# Altium project UL-SWAP-DAQ-2-MODULE.PrjPcb
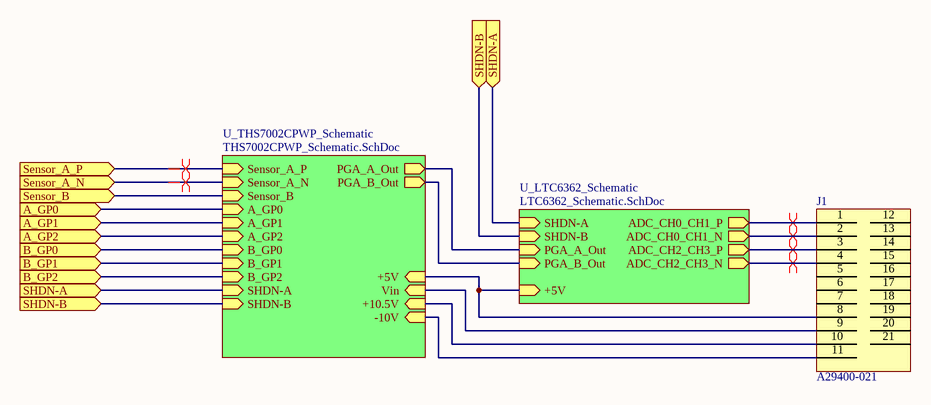
[diagram p0: CONNECTED-MODULE.SchDoc]
3 sheets, 47 parts. Net scope: hierarchical (ports join the sheet entries above them; power ports are global).
Board file: UL-SWAP-DAQ-3-MODULE.PcbDoc
Sheets:
  CONNECTED-MODULE.SchDoc
    U_LTC6362_Schematic = LTC6362_Schematic.SchDoc
    U_THS7002CPWP_Schematic = THS7002CPWP_Schematic.SchDoc

## Sheet CONNECTED-MODULE.SchDoc
size A; SheetNumber: 1; SheetTotal: 3

### Parts
J1  A29400-021

### Sub-sheets
U_LTC6362_Schematic = LTC6362_Schematic.SchDoc: SHDN-A (in), SHDN-B (in), ADC_CH2_CH3_P (out), ADC_CH2_CH3_N (out), ADC_CH0_CH1_P (out), ADC_CH0_CH1_N (out), PGA_A_Out (in), PGA_B_Out (in), +5V (in)
U_THS7002CPWP_Schematic = THS7002CPWP_Schematic.SchDoc: Sensor_A_P (in), Sensor_A_N (in), Sensor_B (in), A_GP0 (in), B_GP0 (in), A_GP1 (in), A_GP2 (in), B_GP1 (in), B_GP2 (in), SHDN-A (in), SHDN-B (in), PGA_A_Out (out), PGA_B_Out (out), +10.5V (in), -10V (in), +5V (in), Vin (in)

### Ports
A_GP0 (in), A_GP1 (in), A_GP2 (in), B_GP0 (in), B_GP1 (in), B_GP2 (in), Sensor_A_N (in), Sensor_A_P (in), Sensor_B (in), SHDN-A (in), SHDN-B (in)

### Nets
+5V: J1.8 ; sheet U_LTC6362_Schematic/+5V, sheet U_THS7002CPWP_Schematic/+5V
+10.5V: J1.10 ; sheet U_THS7002CPWP_Schematic/+10.5V
-10V: J1.11 ; sheet U_THS7002CPWP_Schematic/-10V
A_GP0: port A_GP0, sheet U_THS7002CPWP_Schematic/A_GP0
A_GP1: port A_GP1, sheet U_THS7002CPWP_Schematic/A_GP1
A_GP2: port A_GP2, sheet U_THS7002CPWP_Schematic/A_GP2
ADC_CH0_CH1_N: J1.2 ; sheet U_LTC6362_Schematic/ADC_CH0_CH1_N
ADC_CH0_CH1_P: J1.1 ; sheet U_LTC6362_Schematic/ADC_CH0_CH1_P
ADC_CH2_CH3_N: J1.4 ; sheet U_LTC6362_Schematic/ADC_CH2_CH3_N
ADC_CH2_CH3_P: J1.3 ; sheet U_LTC6362_Schematic/ADC_CH2_CH3_P
B_GP0: port B_GP0, sheet U_THS7002CPWP_Schematic/B_GP0
B_GP1: port B_GP1, sheet U_THS7002CPWP_Schematic/B_GP1
B_GP2: port B_GP2, sheet U_THS7002CPWP_Schematic/B_GP2
PGA_A_Out: sheet U_LTC6362_Schematic/PGA_A_Out, sheet U_THS7002CPWP_Schematic/PGA_A_Out
PGA_B_Out: sheet U_LTC6362_Schematic/PGA_B_Out, sheet U_THS7002CPWP_Schematic/PGA_B_Out
Sensor_A_N: port Sensor_A_N, sheet U_THS7002CPWP_Schematic/Sensor_A_N
Sensor_A_P: port Sensor_A_P, sheet U_THS7002CPWP_Schematic/Sensor_A_P
Sensor_B: port Sensor_B, sheet U_THS7002CPWP_Schematic/Sensor_B
SHDN-A: port SHDN-A, sheet U_LTC6362_Schematic/SHDN-A, sheet U_THS7002CPWP_Schematic/SHDN-A
SHDN-B: port SHDN-B, sheet U_LTC6362_Schematic/SHDN-B, sheet U_THS7002CPWP_Schematic/SHDN-B
Vin: J1.9 ; sheet U_THS7002CPWP_Schematic/Vin

Not connected (* = marked no-connect by the designer): J1 5 6 7 12 13 14 15 16 17 18 19 20 21

### Layout directives
differential pair: ADC_CH0_CH1_N, ADC_CH0_CH1_P, ADC_CH2_CH3_N, ADC_CH2_CH3_P, Sensor_A_N, Sensor_A_P

### Library data of the parts
J1 = A29400-021: 21 Position D-Type, Nano-D Receptacle, Female Sockets Connector

## Sheet LTC6362_Schematic.SchDoc
size A; SheetNumber: 2; SheetTotal: 3
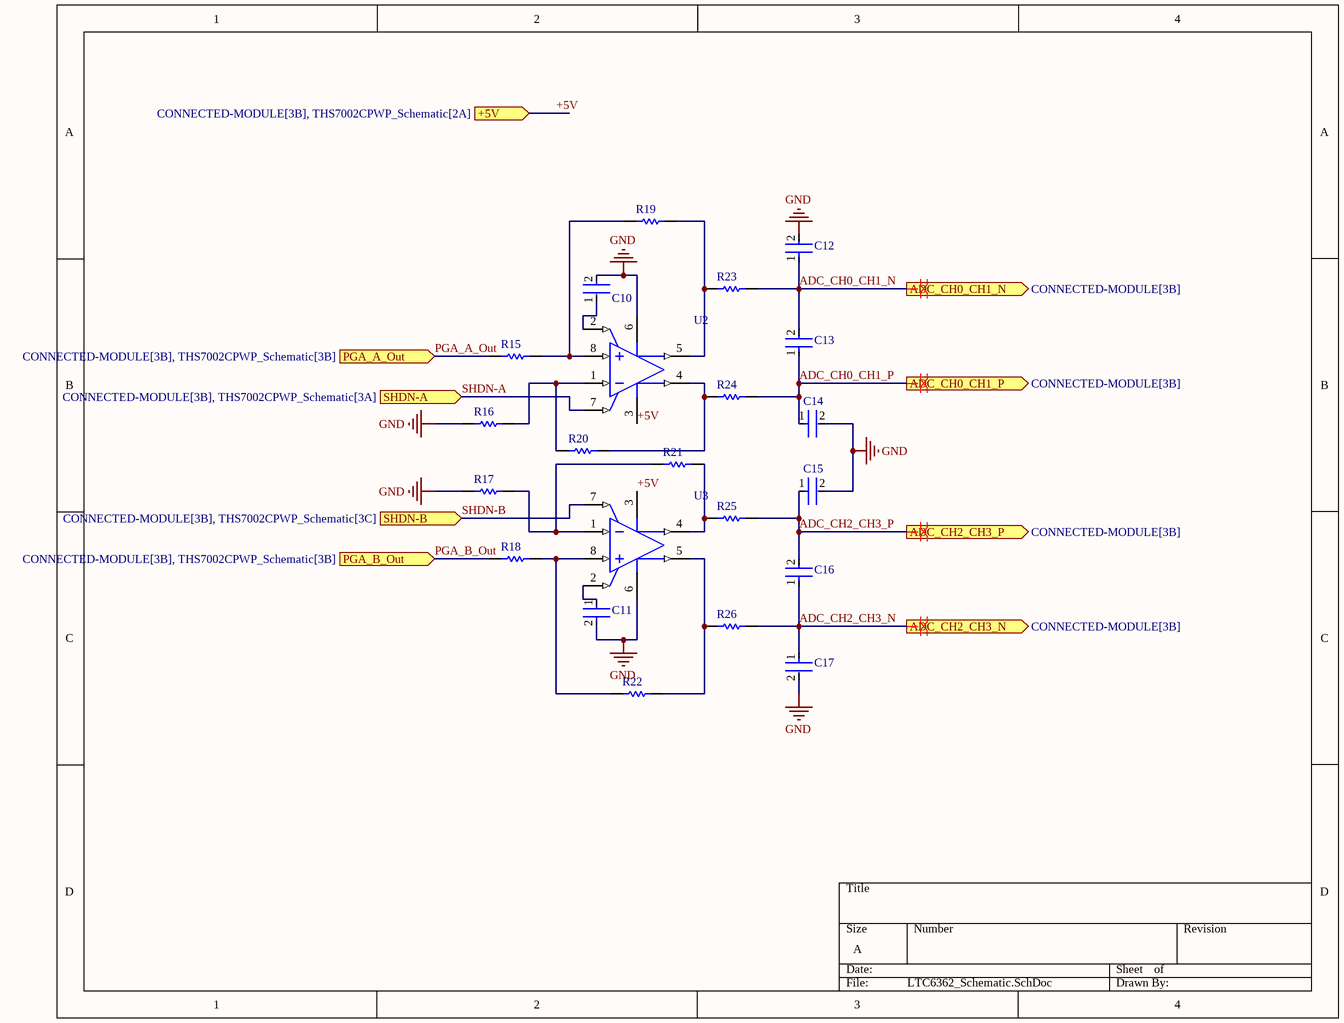
[diagram p1: LTC6362_Schematic.SchDoc]

### Parts
C10  GRM155R71C104KA88D  [FP-GRM15-MFG]  (value not drawn)
C11  GRM155R71C104KA88D  [FP-GRM15-MFG]  (value not drawn)
C12  C0402C392K3RACTU  [FP-C0402-BB-MFG]  (value not drawn)
C13  C0402C392K3RACTU  [FP-C0402-BB-MFG]  (value not drawn)
C14  C0402C392K3RACTU  [FP-C0402-BB-MFG]  (value not drawn)
C15  C0402C392K3RACTU  [FP-C0402-BB-MFG]  (value not drawn)
C16  C0402C392K3RACTU  [FP-C0402-BB-MFG]  (value not drawn)
C17  C0402C392K3RACTU  [FP-C0402-BB-MFG]  (value not drawn)
R15  ERJ-2RKF1241X  [RESC1005X40X25ML05T05]  (value not drawn)
R16  ERJ-2RKF1241X  [RESC1005X40X25ML05T05]  (value not drawn)
R17  ERJ-2RKF1241X  [RESC1005X40X25ML05T05]  (value not drawn)
R18  ERJ-2RKF1241X  [RESC1005X40X25ML05T05]  (value not drawn)
R19  ERJ-2RKF1001X  [RESC1005X40X25NL05T05]  (value not drawn)
R20  ERJ-2RKF1001X  [RESC1005X40X25NL05T05]  (value not drawn)
R21  ERJ-2RKF1001X  [RESC1005X40X25NL05T05]  (value not drawn)
R22  ERJ-2RKF1001X  [RESC1005X40X25NL05T05]  (value not drawn)
R23  RC0402FR-0735R7L  [RESC1005X40X25ML05T10]  (value not drawn)
R24  RC0402FR-0735R7L  [RESC1005X40X25ML05T10]  (value not drawn)
R25  RC0402FR-0735R7L  [RESC1005X40X25ML05T10]  (value not drawn)
R26  RC0402FR-0735R7L  [RESC1005X40X25ML05T10]  (value not drawn)
U2  LTC6362HMS8#PBF  [LT-MS8-8_L]  (value not drawn)
U3  LTC6362HMS8#PBF  [LT-MS8-8_L]  (value not drawn)

### Ports
+5V (in, see CONNECTED-MODULE[3B], THS7002CPWP_Schematic[2A]), ADC_CH0_CH1_N (out, see CONNECTED-MODULE[3B]), ADC_CH0_CH1_P (out, see CONNECTED-MODULE[3B]), ADC_CH2_CH3_N (out, see CONNECTED-MODULE[3B]), ADC_CH2_CH3_P (out, see CONNECTED-MODULE[3B]), PGA_A_Out (in, see CONNECTED-MODULE[3B], THS7002CPWP_Schematic[3B]), PGA_B_Out (in, see CONNECTED-MODULE[3B], THS7002CPWP_Schematic[3B]), SHDN-A (in, see CONNECTED-MODULE[3B], THS7002CPWP_Schematic[3A]), SHDN-B (in, see CONNECTED-MODULE[3B], THS7002CPWP_Schematic[3C])

### Nets
GND: C10.2 C11.2 C12.2 C14.2 C15.2 C17.2 R16.1 R17.1 U2.6(V-) U3.6(V-)
+5V: U2.3(V+) U3.3(V+) ; port +5V
ADC_CH0_CH1_N: C12.1 C13.2 R23.2 ; port ADC_CH0_CH1_N
ADC_CH0_CH1_P: C13.1 C14.1 R24.2 ; port ADC_CH0_CH1_P
ADC_CH2_CH3_N: C16.1 C17.1 R26.2 ; port ADC_CH2_CH3_N
ADC_CH2_CH3_P: C15.1 C16.2 R25.2 ; port ADC_CH2_CH3_P
PGA_A_Out: R15.1 ; port PGA_A_Out
PGA_B_Out: R18.1 ; port PGA_B_Out
SHDN-A: U2.7(~{SHDN}) ; port SHDN-A
SHDN-B: U3.7(~{SHDN}) ; port SHDN-B
NetC10_1: C10.1 U2.2(VOCM)
NetC11_1: C11.1 U3.2(VOCM)
NetR15_2: R15.2 R19.1 U2.8(+IN)
NetR16_2: R16.2 R20.1 U2.1(-IN)
NetR17_2: R17.2 R21.1 U3.1(-IN)
NetR18_2: R18.2 R22.1 U3.8(+IN)
NetR19_2: R19.2 R23.1 U2.5(-OUT)
NetR20_2: R20.2 R24.1 U2.4(+OUT)
NetR21_2: R21.2 R25.1 U3.4(+OUT)
NetR22_2: R22.2 R26.1 U3.5(-OUT)

### Layout directives
differential pair: ADC_CH0_CH1_N, ADC_CH0_CH1_P, ADC_CH2_CH3_N, ADC_CH2_CH3_P

### Library data of the parts
C10 C11 = CMP-2100-03641-2: CAP CER 0.1UF 16V X7R 0402; Manufacturer: Murata; Standoff Height: 0mm; Tolerance: 10%; Voltage Rating: 16Vdc; Material: Ceramic; Capacitance: 0.10μF; Value: 0.10μF; RoHS: TRUE; Manufacturer Part Number: GRM155R71C104KA88D; Temperature Characteristic: X7R; Octopart: https://octopart.com/grm155r71c104ka88d-murata-196880; Digikey Description: CAP CER 0.1UF 16V X7R 0402; Device Class L3: Ceramic Capacitors; Height: 0.55mm; ComponentLink2Description: Datasheet; Temperature Range Low: -55°C; Ipc Land Pattern Name: CAPC10050X219; ComponentLink2URL: https://search.murata.co.jp/Ceramy/image/img/A01X/G101/ENG/GRM155R71H471KA01-01A.pdf; Device Class L1: Passive Components; Lead Free: yes; Category: Cap; Package: GRM15; Temperature: -55°C to +125°C; Device Class L2: Capacitors; Temperature Range High: +125°C; Mouser Description: 0402 0.1 uF 16V ±10 % Tolerance X7R SMT Multilayer Ceramic Capacitor
C12-C17 = CMP-2008-03191-2: CAP CER 3900PF 25V X7R 0402; Manufacturer: Kemet; Value: 3,900 pF; Material: Ceramic; Temperature Coefficient: 15%; Tolerance: 0.1; Temperature Characteristic: X7R; Height: 0.55mm; Temperature: -55°C to +125°C; Temperature Range High: +125°C; Automotive: No; RoHS: TRUE; Manufacturer Part Number: C0402C392K3RACTU; Mouser Description: Capacitor; Ceramic; Cap 3900pF; Tol 10%; SMT; Vol-Rtg 50V; X7R; ComponentLink2URL: https://content.kemet.com/datasheets/KEM_C1002_X7R_SMD.pdf; Octopart: https://octopart.com/c0402c392k3ractu-kemet-141288; Category: Cap; Lead Free: Yes; Device Class L1: Passive Components; Package: C0402-BB; ComponentLink2Description: Datasheet; Digikey Description: CAP CER 3900PF 25V X7R 0402; Voltage Rating: 25 V; Capacitance: 3,900 pF; Ipc Land Pattern Name: CAPC10050X50; Temperature Range Low: -55°C; Device Class L2: Capacitors; Device Class L3: Ceramic Capacitors
R15-R18 = CMP-2002-00652-1: Manufacturer: Panasonic; Part Number: ERJ-2RKF1241X
R19-R22 = CMP-1011-00510-4: Chip Resistor, 1 KOhm, +/- 1%, 100 mW, -55 to 155 degC, 0402 (1005 Metric), RoHS, Tape and Reel; Manufacturer: Basic Passives; Voltage Rating: 50 V; Case\/Package: 0402; Resistance: 1 KOhm; Power Rating: 100 mW; PartNumber: ERJ-2RKF1001X; DatasheetVersion: 04/2015; Radiation Hardening: No; Pins: 2; Height: 0.35 mm; RoHSCompliant: true; Case Code (Imperial): 0402; ComponentLink2Description: Datasheet; ComponentLink1Description: Manufacturer URL; PackageReference: 0402; Mount: Surface Mount; Package Quantity: 10000; Tolerance: 1%; ComponentLink1URL: http://www.panasonic.com/; PackageDescription: 2-Pin Surface Mount Device, Body 1 x 0.5 mm; Mounting Technology: Surface Mount; Case Code (Metric): 1005; ComponentLink2URL: http://industrial.panasonic.com/cdbs/www-data/pdf/RDA0000/AOA0000C86.pdf; REACH SVHC: Yes; Packaging: Tape and Reel; Max Operating Temperature: 155 degC; Min Operating Temperature: -55 degC; Width: 0.5 mm; Length: 1 mm
R23-R26 = CMP-2002-07630-1: Manufacturer: Yageo; Part Number: RC0402FR-0735R7L
U2 U3 = CMP-0359-00920-2: Single Channel, Precision, Low Power Differential Operational Amplifier / SAR ADC Driver, RRIO, 180 MHz Typical GBW, 45 V/us Typical SR, 2.8 to 5.25 V, 8-Pin SOP (MS8-8), High Temperature / Automotive, Pb-Free; Manufacturer: Linear Technology; Vs Max (V): 5.25; Is (mA) Typical: 0.9; SR (V/us) Typical: 45; Channels (#): 1; GBW (MHz) Typical: 180; Vos (mV) Typical: 0.05; Vs Min (V): 2.8; PartNumber: LTC6362HMS8#PBF; PackageDescription: 8-Lead Plastic Small Outline, Body 3.9 x 4.9 mm, Pitch 1.27 mm; ComponentLink2Description: Datasheet; ComponentLink3URL: http://cds.linear.com/docs/en/packaging/05081610_G_SO8.pdf; ComponentLink1Description: Manufacturer URL; PackageReference: LT-MS8-8; ComponentLink2URL: http://cds.linear.com/docs/en/datasheet/6362fa.pdf; PackageVersion: Rev G; Mounting Technology: Surface Mount; Linear Technology Part Number: LTC6362; DatasheetVersion: Rev. A; RevisionNote: URLs updated; RoHS: Pb-Free; ComponentLink1URL: http://www.linear.com/; Type: DIFF; ComponentLink3Description: Package Specification

## Sheet THS7002CPWP_Schematic.SchDoc
size A; SheetNumber: 3; SheetTotal: 3
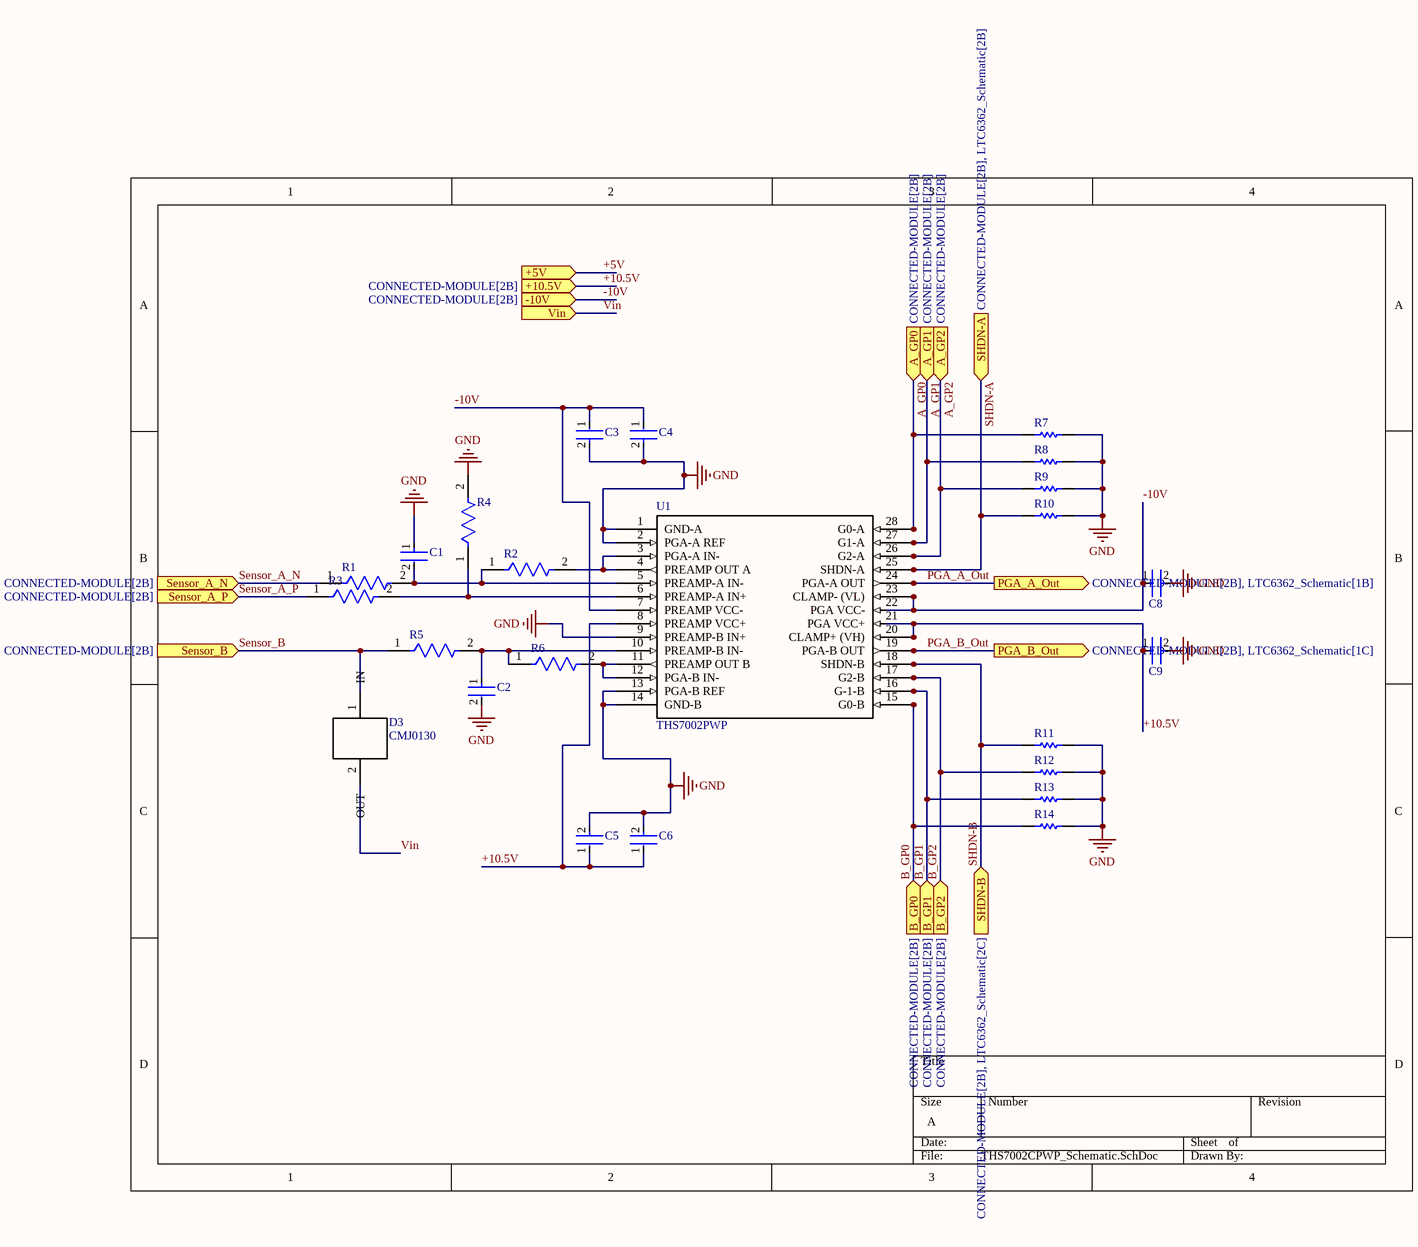
[diagram p2: THS7002CPWP_Schematic.SchDoc]

### Parts
C1  GRM1557U1A302JA01D  [FP-GRM155-0_05-IPC_B]  (value not drawn)
C2  C0603C622J5GACTU  [FP-C0603C-CF-MFG]  (value not drawn)
C3  GRM155R71C104KA88D  [FP-GRM15-MFG]  (value not drawn)
C4  C1608X5R1A685K080AC  [FP-C1608-080-0_1-IPC_B]  (value not drawn)
C5  GRM155R71C104KA88D  [FP-GRM15-MFG]  (value not drawn)
C6  C1608X5R1A685K080AC  [FP-C1608-080-0_1-IPC_B]  (value not drawn)
C8  GRM155R71C104KA88D  [FP-GRM15-MFG]  (value not drawn)
C9  GRM155R71C104KA88D  [FP-GRM15-MFG]  (value not drawn)
D3  CMJ0130  [CMJ2000_Footprint]
R1  CRCW0402499RFKED  [FP-CRCW0402-e3-IPC_A]  (value not drawn)
R2  CRCW0402499RFKED  [FP-CRCW0402-e3-IPC_A]  (value not drawn)
R3  CRCW0402499RFKED  [FP-CRCW0402-e3-IPC_A]  (value not drawn)
R4  CRCW0402499RFKED  [FP-CRCW0402-e3-IPC_A]  (value not drawn)
R5  CRCW0402499RFKED  [FP-CRCW0402-e3-IPC_A]  (value not drawn)
R6  CRCW0402499RFKED  [FP-CRCW0402-e3-IPC_A]  (value not drawn)
R7  ERJ-2RKF3301X  [RESC1005X40X25ML05T05]  (value not drawn)
R8  ERJ-2RKF3301X  [RESC1005X40X25ML05T05]  (value not drawn)
R9  ERJ-2RKF3301X  [RESC1005X40X25ML05T05]  (value not drawn)
R10  ERJ-2RKF3301X  [RESC1005X40X25ML05T05]  (value not drawn)
R11  ERJ-2RKF3301X  [RESC1005X40X25ML05T05]  (value not drawn)
R12  ERJ-2RKF3301X  [RESC1005X40X25ML05T05]  (value not drawn)
R13  ERJ-2RKF3301X  [RESC1005X40X25ML05T05]  (value not drawn)
R14  ERJ-2RKF3301X  [RESC1005X40X25ML05T05]  (value not drawn)
U1  THS7002PWP  [PWP0028E_N]

### Ports
+5V (in), +10.5V (in, see CONNECTED-MODULE[2B]), -10V (in, see CONNECTED-MODULE[2B]), A_GP0 (in, see CONNECTED-MODULE[2B]), A_GP1 (in, see CONNECTED-MODULE[2B]), A_GP2 (in, see CONNECTED-MODULE[2B]), B_GP0 (in, see CONNECTED-MODULE[2B]), B_GP1 (in, see CONNECTED-MODULE[2B]), B_GP2 (in, see CONNECTED-MODULE[2B]), PGA_A_Out (out, see CONNECTED-MODULE[2B], LTC6362_Schematic[1B]), PGA_B_Out (out, see CONNECTED-MODULE[2B], LTC6362_Schematic[1C]), Sensor_A_N (in, see CONNECTED-MODULE[2B]), Sensor_A_P (in, see CONNECTED-MODULE[2B]), Sensor_B (in, see CONNECTED-MODULE[2B]), SHDN-A (in, see CONNECTED-MODULE[2B], LTC6362_Schematic[2B]), SHDN-B (in, see CONNECTED-MODULE[2B], LTC6362_Schematic[2C]), Vin (in)

### Nets
GND: C1.1 C2.2 C3.2 C4.2 C5.2 C6.2 C8.2 C9.2 R4.2 R7.2 R8.2 R9.2 R10.2 R11.2 R12.2 R13.2 R14.2 U1.1(GND-A) U1.2(PGA-A_REF) U1.9(PREAMP-B_IN+) U1.13(PGA-B_REF) U1.14(GND-B)
+10.5V: C5.1 C6.1 C9.1 U1.8(PREAMP_VCC+) U1.20(CLAMP+_(VH)) U1.21(PGA_VCC+) ; port +10.5V
-10V: C3.1 C4.1 C8.1 U1.7(PREAMP_VCC-) U1.22(PGA_VCC-) U1.23(CLAMP-_(VL)) ; port -10V
A_GP0: R7.1 U1.28(G0-A) ; port A_GP0
A_GP1: R8.1 U1.27(G1-A) ; port A_GP1
A_GP2: R9.1 U1.26(G2-A) ; port A_GP2
B_GP0: R14.1 U1.15(G0-B) ; port B_GP0
B_GP1: R13.1 U1.16(G-1-B) ; port B_GP1
B_GP2: R12.1 U1.17(G2-B) ; port B_GP2
PGA_A_Out: U1.24(PGA-A_OUT) ; port PGA_A_Out
PGA_B_Out: U1.19(PGA-B_OUT) ; port PGA_B_Out
Sensor_A_N: R1.1 ; port Sensor_A_N
Sensor_A_P: R3.1 ; port Sensor_A_P
Sensor_B: R5.1 ; port Sensor_B
SHDN-A: R10.1 U1.25(SHDN-A) ; port SHDN-A
SHDN-B: R11.1 U1.18(SHDN-B) ; port SHDN-B
NetC1_2: C1.2 R1.2 R2.1 U1.5(PREAMP-A_IN-)
NetC2_1: C2.1 R5.2 R6.1 U1.10(PREAMP-B_IN-)
NetR2_2: R2.2 U1.3(PGA-A_IN-) U1.4(PREAMP_OUT_A)
NetR3_2: R3.2 R4.1 U1.6(PREAMP-A_IN+)
NetR6_2: R6.2 U1.11(PREAMP_OUT_B) U1.12(PGA-B_IN-)

Not connected (* = marked no-connect by the designer): D3 1(IN) 2(OUT)

### Library data of the parts
C1 = CMP-2008-04488-2: Chip Multilayer Ceramic Capacitors for General Purpose, 0402, 3000pF, U2J, -750ppm/°C, 5%, 10V; Capacitance: 3nF; Termination: SMD/SMT; Case Code (Imperial): 0402; Radiation Hardening: No; Mount: Surface Mount; Tolerance: 5%; Packaging: Tape and Reel; Thickness: 0.022inch; Max Operating Temperature: 125°C; Length: 1mm; Min Operating Temperature: -55°C; Voltage Rating (DC): 10V; Dielectric: U2J; Depth: 0.5mm; Lead Free: Lead Free; Width: 0.5mm; Package Quantity: 10000; Height: 0.5mm; Case Code (Metric): 1005; Voltage Rating: 10V; Case/Package: 0402
C2 = CMP-1035-02247-3: Multilayer Ceramic Capacitor, C Series, 6200 Pf, - 5%, C0g / Np0, 50 V, 0603 [1608 Metric] Rohs Compliant: Yes; Manufacturer: KEMET; Voltage Rating: 50 V; Capacitance: 6,200 pF; Automotive Grade: Grade 1; Value: 6,200 pF; Temperature Coefficient: 30ppm/°C; Tolerance: 0.05; Device Class L1: Passive Components; Temperature Range Low: -55°C; Temperature Range High: +125°C; Height: 0.87mm; Temperature Characteristic: C0G; ComponentLink2URL: https://api.kemet.com/component-edge/download/datasheet/C0603C100J5GACAUTO.pdf; RoHS: TRUE; Lead Free: Yes; Material: Ceramic; Category: Cap; Package: C0603C-CF; Octopart: https://octopart.com/c0603c622j5gactu-kemet-19757383; Device Class L3: Ceramic Capacitors; Automotive: Yes; Temperature: -55°C to +125°C; Mouser Description: Multilayer Ceramic Capacitors MLCC - SMD/SMT 50volts 6200pF 5% C0G; Digikey Description: Multilayer Ceramic Capacitor, C Series, 6200 Pf, - 5%, C0g / Np0, 50 V, 0603 [1608 Metric] Rohs Compliant: Yes; Device Class L2: Capacitors; Manufacturer Part Number: C0603C622J5GACTU; ComponentLink2Description: Datasheet
C3 C5 C8 C9 = CMP-2100-03641-2: as C10 on sheet LTC6362_Schematic; RoHS: TRUE; Manufacturer Part Number: GRM155R71C104KA88D; Temperature Characteristic: X7R; Octopart: https://octopart.com/grm155r71c104ka88d-murata-196880; Digikey Description: CAP CER 0.1UF 16V X7R 0402; Device Class L3: Ceramic Capacitors; Height: 0.55mm; ComponentLink2Description: Datasheet; Temperature Range Low: -55°C; Ipc Land Pattern Name: CAPC10050X219; ComponentLink2URL: https://search.murata.co.jp/Ceramy/image/img/A01X/G101/ENG/GRM155R71H471KA01-01A.pdf; Device Class L1: Passive Components; Lead Free: yes; Category: Cap; Package: GRM15; Temperature: -55°C to +125°C; Device Class L2: Capacitors; Temperature Range High: +125°C; Mouser Description: 0402 0.1 uF 16V ±10 % Tolerance X7R SMT Multilayer Ceramic Capacitor
C4 C6 = CMP-08246-004364-1: Multilayer Ceramic Capacitors 6.8μF ±10% 10V X5R SMD 0603; Capacitance: 6.8uF; Construction: Flat; Depth: 0.8mm; Case Code (Imperial): 0603; Min Operating Temperature: -55°C; Dielectric: X5R; Lead Free: Lead Free; Termination: SMD/SMT; REACH SVHC: No SVHC; Tolerance: 10%; Voltage Rating: 10V; Packaging: Tape and Reel; Dielectric Material: Ceramic; Width: 0.031inch; Length: 1.6mm; Height: 0.8mm; Mount: Surface Mount; Thickness: 0.035inch; Max Operating Temperature: 85°C; Case Code (Metric): 1608; Series: C; Voltage Rating (DC): 10V; Package Quantity: 1; Case/Package: 0603; Weight: 7.1E-05oz; RoHS Compliant: Yes
D3 = CMJ2000/0130: CMJ2000: DIODE CUR REG 100V 2.32MA 500MW; CMJ0130 DIODE CUR REG 100V 0.5mA 500MW; ComponentLink1Description: New link; ComponentLink1URL: *
R1-R6 = CMP-2002-00037-2: RES Thick Film, 499Ω, 1%, 0.063W, 100ppm/°C, 0402; Voltage Rating: 50V; Resistance: 499R; Max Power Dissipation: 63mW; Max Operating Temperature: 155°C; Termination: SMD/SMT; Working Voltage: 50V; Case/Package: 0402; Case Code (Imperial): 0402; Radiation Hardening: No; Contact Plating: Tin; Weight: 2.3E-05oz; Height: 0.35mm; Packaging: Tape and Reel; Temperature Coefficient: 100ppm/°C; Min Operating Temperature: -55°C; Lead Free: Lead Free; Tolerance: 1%; Case Code (Metric): 1005; Composition: Thick Film; Mount: Surface Mount; Depth: 0.5mm; Number of Terminations: 2; Power Rating: 63mW; Width: 0.02inch; Voltage Rating (DC): 50V; Package Quantity: 10; Features: Automotive AEC-Q200; Military Standard: Not; Length: 1mm
R7-R14 = CMP-1011-00567-3: Chip Resistor, 3.3 KOhm, +/- 1%, 0.1 W, -55 to 155 degC, 0402 (1005 Metric), RoHS, Tape and Reel; Manufacturer: Panasonic; Max Power Dissipation: 100mW; Voltage Rating: 50V; Temperature Coefficient: 100ppm/degreesC; Case Code (Metric): 1005; Max Operating Temperature: 155degC; Contact Plating: Tin; Power Rating: 100mW; Datasheet URL: https://industrial.panasonic.com/cdbs/www-data/pdf/RDA0000/AOA0000C283.pdf; Length: 1mm; Tolerance: 1%; REACH SVHC: NoSVHC; Depth: 0.5mm; Composition: ThickFilm; Package Description: 2-Pin Surface Mount Device, Body 1 x 0.5 mm; Case Code (Imperial): 0402; Lead Free: LeadFree; Manufacturer URL: http://www.panasonic.com/; Datasheet Version: 42095.0; Packaging: TapeandReel; Termination: SMD/SMT; RoHSCompliant: true; Height: 0.35mm; Military Standard: Not; Case/Package: 0402; Voltage Rating (DC): 50V; Radiation Hardening: No; Mount: SurfaceMount; Width: 0.02inch; Package Reference: 0402; Resistance: 3.3KOhm; Min Operating Temperature: -55degC; Number of Terminations: 2; Package Quantity: 1; Number of Pins: 2
U1 = Component_1

## Nets that join several sheets
GND: LTC6362_Schematic (10 pins), THS7002CPWP_Schematic (22 pins)
+5V: CONNECTED-MODULE (J1.8), LTC6362_Schematic (U2.3 U3.3)
+10.5V: CONNECTED-MODULE (J1.10), THS7002CPWP_Schematic (6 pins)
-10V: CONNECTED-MODULE (J1.11), THS7002CPWP_Schematic (6 pins)
ADC_CH0_CH1_N: CONNECTED-MODULE (J1.2), LTC6362_Schematic (C12.1 C13.2 R23.2)
ADC_CH0_CH1_P: CONNECTED-MODULE (J1.1), LTC6362_Schematic (C13.1 C14.1 R24.2)
ADC_CH2_CH3_N: CONNECTED-MODULE (J1.4), LTC6362_Schematic (C16.1 C17.1 R26.2)
ADC_CH2_CH3_P: CONNECTED-MODULE (J1.3), LTC6362_Schematic (C15.1 C16.2 R25.2)
PGA_A_Out: LTC6362_Schematic (R15.1), THS7002CPWP_Schematic (U1.24)
PGA_B_Out: LTC6362_Schematic (R18.1), THS7002CPWP_Schematic (U1.19)
SHDN-A: LTC6362_Schematic (U2.7), THS7002CPWP_Schematic (R10.1 U1.25)
SHDN-B: LTC6362_Schematic (U3.7), THS7002CPWP_Schematic (R11.1 U1.18)